# Altium project 32最小系统板.PrjPcb
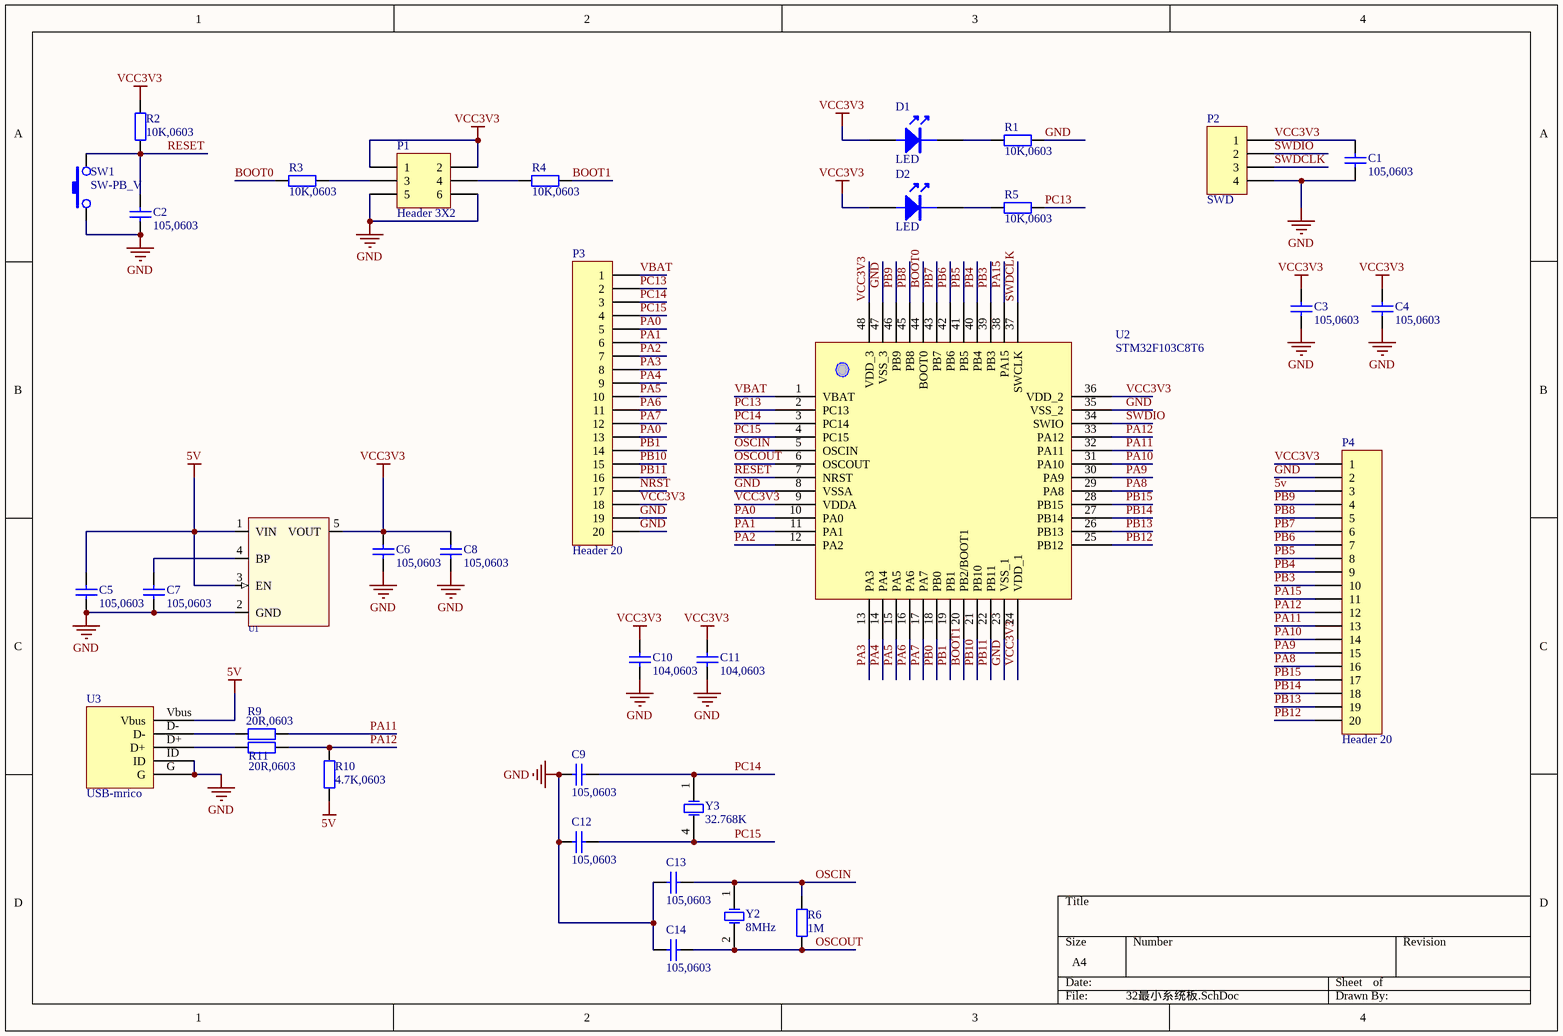
[diagram p0: 32最小系统板.SchDoc]
1 sheet, 35 parts. Net scope: global (net labels, ports and power ports of the same name join across sheets).
Board file: 32最小系统板.PcbDoc

## Sheet 32最小系统板.SchDoc
size A4; SheetNumber: 1; SheetTotal: 1

### Parts
C1  105,0603  [C0603]
C2  105,0603  [C0603]
C3  105,0603  [C0603]
C4  105,0603  [C0603]
C5  105,0603  [C0603]
C6  105,0603  [C0603]
C7  105,0603  [C0603]
C8  105,0603  [C0603]
C9  105,0603  [C0603]
C10  104,0603  [C0603]
C11  104,0603  [C0603]
C12  105,0603  [C0603]
C13  105,0603  [C0603]
C14  105,0603  [C0603]
D1  LED  [LED]
D2  LED  [LED]
P1  Header 3X2  [HDR2X3]
P2  SWD  [HDR1X4]
P3  Header 20  [HDR1X20]
P4  Header 20  [HDR1X20]
R1  10K,0603  [R0603]
R2  10K,0603  [R0603]
R3  10K,0603  [R0603]
R4  10K,0603  [R0603]
R5  10K,0603  [R0603]
R6  1M  [R0603]
R9  20R,0603  [R0603]
R10  4.7K,0603  [R0603]
R11  20R,0603  [R0603]
SW1  SW-PB_V  [KEY-SMT]
U1  RT9193  [SOT-23-5]  (value not drawn)
U2  STM32F103C8T6  [48P]
U3  USB-mrico  [Micro_USB]
Y2  8MHz  [XTAL1]
Y3  32.768K  [MC-306]

### Nets
5v: C5.2 P4.3 R10.2 U1.1(VIN) U1.3(EN) U3.Vbus
GND: C1.1 C2.1 C3.1 C4.1 C5.1 C6.1 C7.1 C8.1 C9.2 C10.1 C11.1 C12.2 C13.2 C14.2 P1.5 P1.6 P2.4 P3.19 P3.20 P4.2 R1.2 SW1.1 U1.2(GND) U2.8(VSSA) U2.23(VSS_1) U2.35(VSS_2) U2.47(VSS_3) U3.G U3.ID
VCC3V3: C1.2 C3.2 C4.2 C6.2 C8.2 C10.2 C11.2 D1.A D2.A P1.1 P1.2 P2.1 P3.18 P4.1 R2.2 U1.5(VOUT) U2.9(VDDA) U2.24(VDD_1) U2.36(VDD_2) U2.48(VDD_3)
BOOT0: R3.1 U2.44(BOOT0)
BOOT1: R4.2 U2.20(PB2/BOOT1)
NRST: P3.17
OSCIN: C13.1 R6.2 U2.5(OSCIN) Y2.1(OSC1)
OSCOUT: C14.1 R6.1 U2.6(OSCOUT) Y2.2(OSC2)
PA0: P3.5 P3.13 U2.10(PA0)
PA1: P3.6 U2.11(PA1)
PA2: P3.7 U2.12(PA2)
PA3: P3.8 U2.13(PA3)
PA4: P3.9 U2.14(PA4)
PA5: P3.10 U2.15(PA5)
PA6: P3.11 U2.16(PA6)
PA7: P3.12 U2.17(PA7)
PA8: P4.16 U2.29(PA8)
PA9: P4.15 U2.30(PA9)
PA10: P4.14 U2.31(PA10)
PA11: P4.13 R9.1 U2.32(PA11)
PA12: P4.12 R10.1 R11.1 U2.33(PA12)
PA15: P4.11 U2.38(PA15)
PB0: U2.18(PB0)
PB1: P3.14 U2.19(PB1)
PB3: P4.10 U2.39(PB3)
PB4: P4.9 U2.40(PB4)
PB5: P4.8 U2.41(PB5)
PB6: P4.7 U2.42(PB6)
PB7: P4.6 U2.43(PB7)
PB8: P4.5 U2.45(PB8)
PB9: P4.4 U2.46(PB9)
PB10: P3.15 U2.21(PB10)
PB11: P3.16 U2.22(PB11)
PB12: P4.20 U2.25(PB12)
PB13: P4.19 U2.26(PB13)
PB14: P4.18 U2.27(PB14)
PB15: P4.17 U2.28(PB15)
PC13: P3.2 R5.2 U2.2(PC13)
PC14: C9.1 P3.3 U2.3(PC14) Y3.1(OSC1)
PC15: C12.1 P3.4 U2.4(PC15) Y3.4(OSC2)
RESET: C2.2 R2.1 SW1.2 U2.7(NRST)
SWDCLK: P2.3 U2.37(SWCLK)
SWDIO: P2.2 U2.34(SWIO)
VBAT: P3.1 U2.1(VBAT)
NetC7_2: C7.2 U1.4(BP)
NetD1_K: D1.K R1.1
NetD2_K: D2.K R5.1
NetP1_3: P1.3 R3.2
NetP1_4: P1.4 R4.1
NetR9_2: R9.2 U3.D-
NetR11_2: R11.2 U3.D+

### Library data of the parts
C1-C14 = Cap: Capacitor; Value: 104; Published: 8-Jun-2000; LatestRevisionDate: 17-Jul-2002; LatestRevisionNote: Re-released for DXP Platform.; Publisher: Altium Limited
D1 D2 = LED: pin to pad: A>1 K>2
P1 = Header 3X2: Header, 3-Pin, Dual row; LatestRevisionDate: 17-Jul-2002; LatestRevisionNote: Re-released for DXP Platform.; Publisher: Altium Limited
P2 = Header 4: Header, 4-Pin; LatestRevisionDate: 17-Jul-2002; LatestRevisionNote: Re-released for DXP Platform.; Publisher: Altium Limited
P3 P4 = Header 20: Header, 20-Pin; LatestRevisionDate: 17-Jul-2002; LatestRevisionNote: Re-released for DXP Platform.; Publisher: Altium Limited
R1-R6 R9-R11 = Res2: Resistor; Published: 8-Jun-2000; LatestRevisionDate: 17-Jul-2002; LatestRevisionNote: Re-released for DXP Platform.; Publisher: Altium Limited
SW1 = SW-PB_V: SWITCH
U1 = RT9193X_5P: ICA_MFR_NAME: RICHTEK; ICA_PARTNUM: $$2191094$$RT9193-15CU5; Part Number: TMP-13
U3 = usb-STM
Y2 Y3 = XTAL: Crystal Oscillator; Published: 8-Jun-2000; LatestRevisionDate: 17-Jul-2002; LatestRevisionNote: Re-released for DXP Platform.; Publisher: Altium Limited